# Altium schematic sheet Clocking_SI5341B.SchDoc: RFSoC AMC
size 420 x 297 mm; CompanyName: WUT; DrawnBy: T. Przywozki; Organization: WUT ISE; Address1: Warsaw University of Technology; Address2: Nowowiejska 15/19 00-665 Warsaw; Address3: Tomasz.Przywozki@pw.edu.pl; DocumentNumber: 40; Revision: 1; SheetNumber: 40; SheetTotal: 45; Project: RFSoC AMC; ModifiedBy: T. Przywozki; CreateDate: -; CheckedDate: -; DivGrp: ISE; Designer: T. Przywozki; ModifiedDate: -; ProjectName: ADC/DAC MEZZANINE
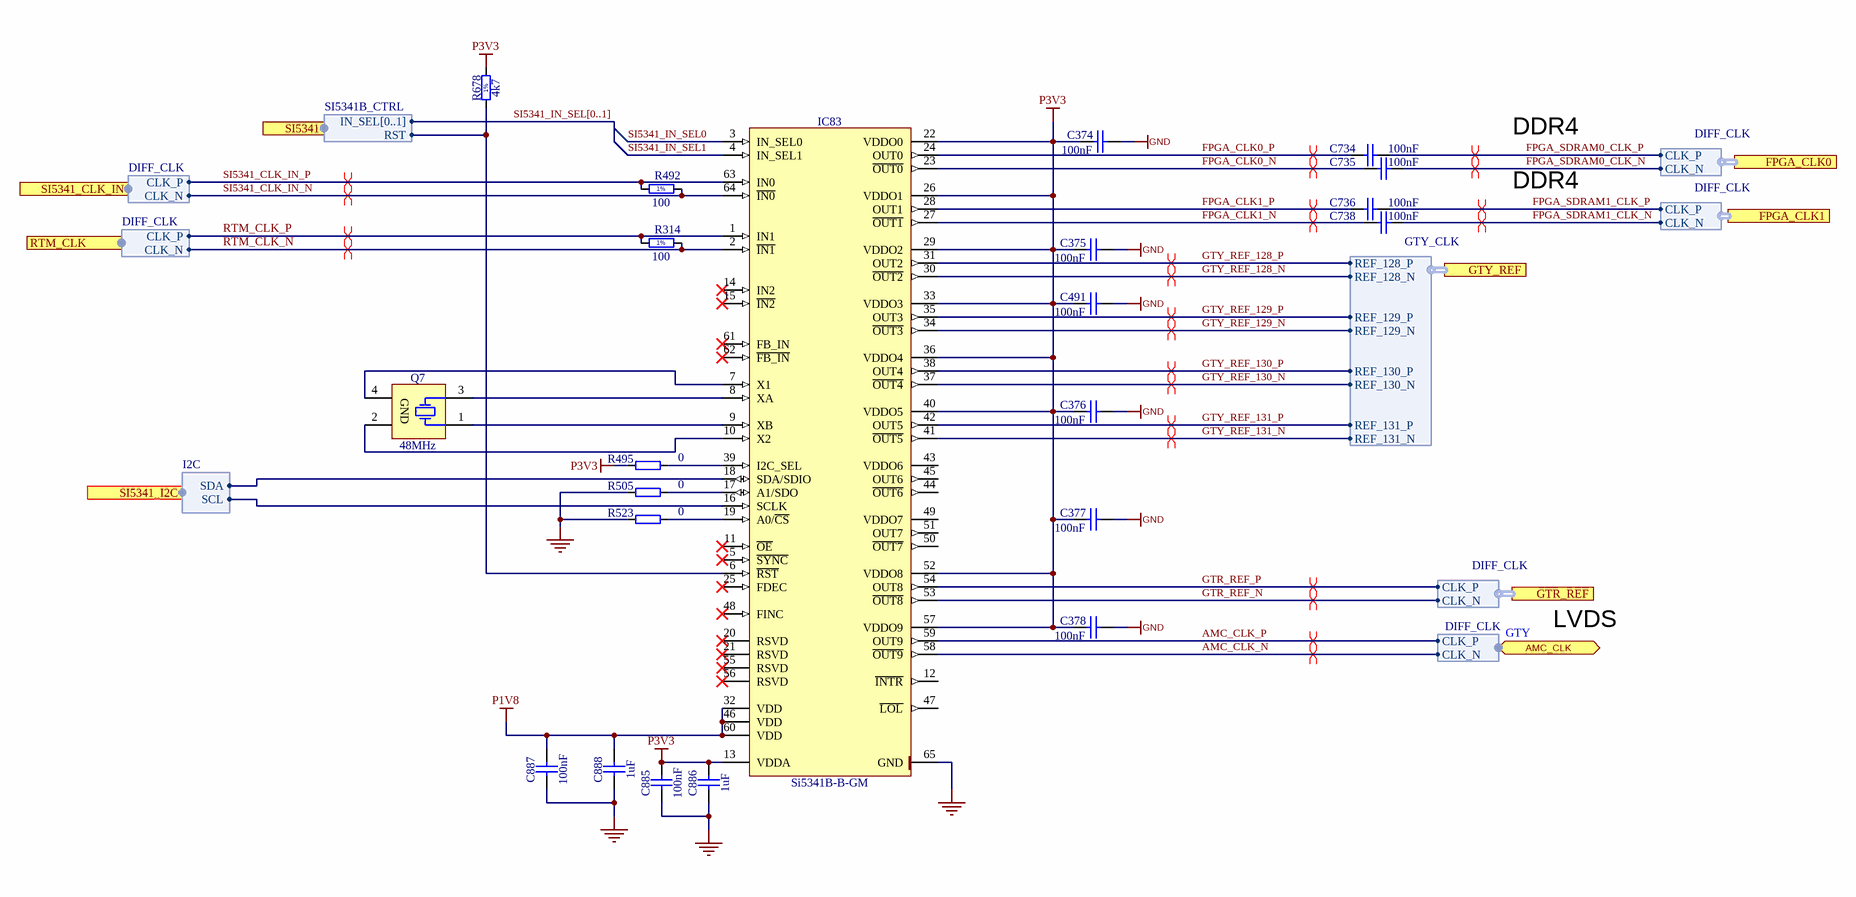
[diagram p0: Clocking_SI5341B.SchDoc]

## Parts
C374  100nF  [CAPC0603X33N]
C375  100nF  [CAPC0603X33N]
C376  100nF  [CAPC0603X33N]
C377  100nF  [CAPC0603X33N]
C378  100nF  [CAPC0603X33N]
C491  100nF  [CAPC0603X33N]
C734  100nF  [CAPC0603X33N]
C735  100nF  [CAPC0603X33N]
C736  100nF  [CAPC0603X33N]
C738  100nF  [CAPC0603X33N]
C885  100nF  [CAPC1005X55N]
C886  1uF  [CAPC1005X55N]
C887  100nF  [CAPC1005X55N]
C888  1uF  [CAPC1005X55N]
IC83  Si5341B-B-GM  [QFN50P900X900X90-65N-S530]
Q7  48MHz  [XTAL_TXC_7M]
R314  100  [RESC1005X40N]
R492  100  [RESC1005X40N]
R495  0  [RESC1005X40N]
R505  0  [RESC1005X40N]
R523  0  [RESC1005X40N]
R678  4k7  [RESC1005X40N]

## Ports
AMC_CLK (bidir, harness DIFF_CLK), FPGA_CLK0 (harness DIFF_CLK), FPGA_CLK1 (harness DIFF_CLK), GTR_REF (harness DIFF_CLK), GTY_REF (harness GTY_CLK), RTM_CLK (harness DIFF_CLK), SI5341 (in, harness SI5341B_CTRL), SI5341_CLK_IN (harness DIFF_CLK), SI5341_I2C (harness I2C)

## Harnesses
I2C: SDA, SCL
DIFF_CLK: CLK_P, CLK_N
GTY_CLK: REF_128_P, REF_128_N, REF_129_P, REF_129_N, REF_130_P, REF_130_N, REF_131_P, REF_131_N
SI5341B_CTRL: IN_SEL[0..1], RST

## Nets
GND: C374.1 C375.1 C376.1 C377.1 C378.1 C491.1 C885.1 C886.2 C887.1 C888.2 IC83.65(GND) R505.1 R523.1
P1V8: C887.2 C888.1 IC83.32(VDD) IC83.46(VDD) IC83.60(VDD)
P3V3: C374.2 C375.2 C376.2 C377.2 C378.2 C491.2 C885.2 C886.1 IC83.13(VDDA) IC83.22(VDDO0) IC83.26(VDDO1) IC83.29(VDDO2) IC83.33(VDDO3) IC83.36(VDDO4) IC83.40(VDDO5) IC83.52(VDDO8) IC83.57(VDDO9) R495.1 R678.2
AMC_CLK_N: IC83.58(~{OUT9}) ; port AMC_CLK.CLK_N
AMC_CLK_P: IC83.59(OUT9) ; port AMC_CLK.CLK_P
FPGA_CLK0_N: C735.1 IC83.23(~{OUT0})
FPGA_CLK0_P: C734.1 IC83.24(OUT0)
FPGA_CLK1_N: C738.1 IC83.27(~{OUT1})
FPGA_CLK1_P: C736.1 IC83.28(OUT1)
FPGA_SDRAM0_CLK_N: C735.2 ; port FPGA_CLK0.CLK_N
FPGA_SDRAM0_CLK_P: C734.2 ; port FPGA_CLK0.CLK_P
FPGA_SDRAM1_CLK_N: C738.2 ; port FPGA_CLK1.CLK_N
FPGA_SDRAM1_CLK_P: C736.2 ; port FPGA_CLK1.CLK_P
GTR_REF_N: IC83.53(~{OUT8}) ; port GTR_REF.CLK_N
GTR_REF_P: IC83.54(OUT8) ; port GTR_REF.CLK_P
GTY_REF_128_N: IC83.30(~{OUT2}) ; port GTY_REF.REF_128_N
GTY_REF_128_P: IC83.31(OUT2) ; port GTY_REF.REF_128_P
GTY_REF_129_N: IC83.34(~{OUT3}) ; port GTY_REF.REF_129_N
GTY_REF_129_P: IC83.35(OUT3) ; port GTY_REF.REF_129_P
GTY_REF_130_N: IC83.37(~{OUT4}) ; port GTY_REF.REF_130_N
GTY_REF_130_P: IC83.38(OUT4) ; port GTY_REF.REF_130_P
GTY_REF_131_N: IC83.41(~{OUT5}) ; port GTY_REF.REF_131_N
GTY_REF_131_P: IC83.42(OUT5) ; port GTY_REF.REF_131_P
RTM_CLK_N: IC83.2(~{IN1}) R314.2 ; port RTM_CLK.CLK_N
RTM_CLK_P: IC83.1(IN1) R314.1 ; port RTM_CLK.CLK_P
SI5341_CLK_IN_N: IC83.64(~{IN0}) R492.2 ; port SI5341_CLK_IN.CLK_N
SI5341_CLK_IN_P: IC83.63(IN0) R492.1 ; port SI5341_CLK_IN.CLK_P
SI5341_IN_SEL0: IC83.3(IN_SEL0)
SI5341_IN_SEL1: IC83.4(IN_SEL1)
NetIC83_6: IC83.6(~{RST}) R678.1 ; port SI5341.RST
NetIC83_7: IC83.7(X1) Q7.4(GND)
NetIC83_8: IC83.8(XA) Q7.3(X)
NetIC83_9: IC83.9(XB) Q7.1(X)
NetIC83_10: IC83.10(X2) Q7.2(GND)
NetIC83_16: IC83.16(SCLK) ; port SI5341_I2C.SCL
NetIC83_17: IC83.17(A1/SDO) R505.2
NetIC83_18: IC83.18(SDA/SDIO) ; port SI5341_I2C.SDA
NetIC83_19: IC83.19(A0/~{CS}) R523.2
NetIC83_39: IC83.39(I2C_SEL) R495.2

Not connected (* = marked no-connect by the designer): IC83 5(~{SYNC})* 11(~{OE})* 12(~{INTR}) 14(IN2)* 15(~{IN2})* 20(RSVD)* 21(RSVD)* 25(FDEC)* 43(VDDO6) 44(~{OUT6}) 45(OUT6) 47(~{LOL}) 48(FINC)* 49(VDDO7) 50(~{OUT7}) 51(OUT7) 55(RSVD)* 56(RSVD)* 61(FB_IN)* 62(~{FB_IN})*

## Buses and harness runs
bus SI5341_IN_SEL[0..1]

## Layout directives
differential pair; net class Diff_100Ohm: AMC_CLK_N, AMC_CLK_P, FPGA_CLK0_N, FPGA_CLK0_P, FPGA_CLK1_N, FPGA_CLK1_P, FPGA_SDRAM0_CLK_N, FPGA_SDRAM0_CLK_P, FPGA_SDRAM1_CLK_N, FPGA_SDRAM1_CLK_P, GTR_REF_N, GTR_REF_P, GTY_REF_128_N, GTY_REF_128_P, GTY_REF_129_N, GTY_REF_129_P, GTY_REF_130_N, GTY_REF_130_P, GTY_REF_131_N, GTY_REF_131_P, RTM_CLK_N, RTM_CLK_P, SI5341_CLK_IN_N, SI5341_CLK_IN_P

## Notes on the sheet
- DDR4
- GTY
- LVDS
- Project/Equipment
- Document
- Designer
- Drawn by
- Check.by
- Copyright WUT ISE 2021
  This documentation describes Open Hardware and is licensed under CERN OHL v.1.1. You may redistribute and modify this documentaction under the terms of the CERN OHL v1.1.
  (http://ohwr.org/CERNOHL). This documentation is dristributed WITHOUT ANY EXPRESS OR IMPLIED WARRANTY, INCLUDING OF MERCHANTABLITY, SATISFACTORY QUALITY AND FITNESS FOR A PARTICULAR PURPOSE. Please see the CERN OHL v.1.1 for applicable conditions
- File
- Last Mod.
- Print Date
- Sheet
- Size
- A3
- of
- Rev
- Contact:
- (in symbol R0402_4K7_1%_0.0625W_100PPM) 1%
- (in symbol R0402_100R_1%_0.0625W_100PPM) 1%

## Library data of the parts
C374-C378 C491 = CC0201_100NF_6.3V_10%_X5R: Non-polarised capacitor; Manufacturer: GENERIC; Part Description: SMD Multilayer Chip Ceramic Capacitor; Manufacturer1 Part Number: 02016D104KAT2A; Tolerance: ±10%; Voltage: 6.3V; TC: X5R; Manufacturer Part Number: CC0201_100NF_6.3V_10%_X5R; Part Number: CC0201_100NF_6.3V_10%_X5R; Value: 100nF; Component Kind: Standard; Component Type: Standard; Pin Count: 2; Status: Not Recommended; Case: 0201; Mounted: Yes; Socket: No; SMD: Yes; Sense: No; Manufacturer1 Example: AVX; Manufacturer1 ComponentHeight: 0.33mm; HelpURL: \\cern.ch\dfs\Applications\Altium\Datasheets\CC0201_X5R_AVX.pdf; Author: CERN DEM JLC; CreateDate: 03/12/2007; LatestRevisionDate: 03/12/2007
C734-C736 C738 = CC0201_100NF_6.3V_10%_X5R: Non-polarised capacitor; Manufacturer: GENERIC; Manufacturer1 Part Number: 02016D104KAT2A; Part Description: SMD Multilayer Chip Ceramic Capacitor; TC: X5R; Tolerance: ±10%; Voltage: 6.3V; Case: 0201; Manufacturer Part Number: CC0201_100NF_6.3V_10%_X5R; Manufacturer1 Example: AVX; Part Number: CC0201_100NF_6.3V_10%_X5R; Pin Count: 2; SMD: Yes; Status: Not Recommended; Value: 100nF; Component Kind: Standard; Component Type: Standard; Mounted: Yes; Socket: No; Sense: No; Manufacturer1 ComponentHeight: 0.33mm; HelpURL: \\cern.ch\dfs\Applications\Altium\Datasheets\CC0201_X5R_AVX.pdf; Author: CERN DEM JLC; CreateDate: 03.12.2007; LatestRevisionDate: 03.12.2007
C885 C887 = CC0402_100NF_25V_10%_X7R_YUDEN_TMK105B7104KVHF: Non-polarised capacitor; Part Description: SMD Multilayer Chip Ceramic Capacitor (High Dielectric Type) for Automotive / Industrial Applications; Manufacturer: TAIYO YUDEN; Voltage: 25V; TC: X7R; Tolerance: ±10%; Part Number: CC0402_100NF_25V_10%_X7R_YUDEN_TMK105B7104KVHF; Component Kind: Standard; Component Type: Standard; Pin Count: 2; Value: 100nF; Status: Not Recommended; Manufacturer Part Number: TMK105B7104KVHF; Case: 0402; Mounted: Yes; Socket: No; SMD: Yes; Sense: No; ComponentHeight: 0.55mm; HelpURL: \\cern.ch\dfs\Applications\Altium\Datasheets\CC0402_TAIYO-YUDEN_TMK105B7104KVHF.pdf; Author: CERN DEM JLC; CreateDate: 10.05.2017; LatestRevisionDate: 10.05.2017
C886 C888 = CC0402_1UF_16V_10%_X5R: Non-polarised capacitor; Part Description: SMD Multilayer Chip Ceramic Capacitor; Manufacturer: GENERIC; Manufacturer1 Part Number: C1005X5R1C105KT; Voltage: 16V; TC: X5R; Tolerance: ±10%; Part Number: CC0402_1UF_16V_10%_X5R; Component Kind: Standard; Component Type: Standard; Pin Count: 2; Value: 1uF; Status: Preferred; Manufacturer Part Number: CC0402_1UF_16V_10%_X5R; Case: 0402; Mounted: Yes; Socket: No; SMD: Yes; Sense: No; Manufacturer1 Example: TDK; Manufacturer1 ComponentHeight: 0.55mm; HelpURL: \\cern.ch\dfs\Applications\Altium\Datasheets\CC0402_X5R_TDK_C.pdf; Author: CERN DEM JLC; CreateDate: 25.10.2012; LatestRevisionDate: 25.10.2012
IC83 = Si5341B-B-GM: Low-Jitter, 10-Output, Any-Frequency, Any-Output, Clock Generator; Part Description: 0.0001 to 350 MHz, Low-Jitter, 4-Input, 10-Output, Clock Generator; Manufacturer: SILICON LABS; PressFit: No; Bonding: No; Part Number: Si5341B-B-GM; Component Kind: Standard; Component Type: Standard; Device: Si5341B-B-GM; PackageDescription: QFN, 0.50mm Pitch, Square; 64 Pin, 9.00mm L X 9.00mm W X 0.90mm H Body (5.30mm X 5.30mm Thermal Tab), IPC Medium Density; Manufacturer Part Number: Si5341B-B-GM; Pin Count: 65; Case: QFN64; Mounted: Yes; Socket: No; SMD: Yes; Sense: No; ComponentHeight: 0.9mm; HelpURL: \\cern.ch\dfs\Applications\Altium\Datasheets\Si5341B-B-GM.pdf; Author: CERN DEM MR; CreateDate: 25.05.2016; LatestRevisionDate: 23.10.2017
Q7 = XTAL_48MHZ_TXC_7M-48.000MAHV: Crystal 4 pins 1=XTAL Control 2=GND3=XTAL 4=GND; Part Description: ±30ppm 8pF -40°C to +85°C  4 Pins, 3.2x2.5X0.8mm, SMD Sealing Crystal, 7M Series; Manufacturer: TXC CORPORATION; PressFit: No; Bonding: No; Part Number: XTAL_48MHZ_TXC_7M-48.000MAHV; Component Kind: Standard; Component Type: Standard; PackageDescription: 4 Pins, 2.5x3.2mm, SMD Sealing Crystal, 7M Serie; Value: 48MHz; Manufacturer Part Number: 7M-48.000MAHV; Pin Count: 4; Mounted: Yes; Socket: No; SMD: Yes; Sense: No; ComponentHeight: 0.8mm; HelpURL: \\cern.ch\dfs\Applications\Altium\Datasheets\XTAL_TXC_7M.pdf; Author: CERN DEM MR; CreateDate: 30.05.2016; LatestRevisionDate: 30.05.2016
R314 R492 = R0402_100R_1%_0.0625W_100PPM: Resistor - 1%; Manufacturer: GENERIC; Part Description: General Purpose Thick Film Chip Resistor; Manufacturer1 Part Number: 232270671001L; TC: ±100ppm/°C; PressFit: No; Manufacturer Part Number: R0402_100R_1%_0.0625W_100PPM; Part Number: R0402_100R_1%_0.0625W_100PPM; Tolerance: ±1%; Value: 100; Component Kind: Standard; Component Type: Standard; Pin Count: 2; Status: Not Recommended; Power: 0.0625W; Case: 0402; Mounted: Yes; Sense: No; Socket: No; SMD: Yes; Manufacturer1 Example: YAGEO PHYCOMP; Manufacturer1 ComponentHeight: 0.4mm; HelpURL: \\cern.ch\dfs\Applications\Altium\Datasheets\R0402_Phycomp_RC0402.pdf; Author: CERN DEM JLC; CreateDate: 03.12.2007; LatestRevisionDate: 17.10.2012
R495 R505 R523 = R0402_0R_JUMPER: Resistor; Manufacturer: GENERIC; Part Description: 1A (0.05R Max DC Resistance) Zero Ohm Jumper; Manufacturer1 Part Number: 232270591001L; PressFit: No; Manufacturer Part Number: R0402_0R_JUMPER; Part Number: R0402_0R_JUMPER; Value: 0; Component Kind: Standard; Component Type: Standard; Pin Count: 2; Status: Not Recommended; Case: 0402; Mounted: Yes; Sense: No; Socket: No; SMD: Yes; Manufacturer1 Example: YAGEO PHYCOMP; Manufacturer1 ComponentHeight: 0.4mm; HelpURL: \\cern.ch\dfs\Applications\Altium\Datasheets\R0402_Phycomp_RC0402.pdf; Author: CERN DEM JLC; CreateDate: 03.12.2007; LatestRevisionDate: 17.10.2012
R678 = R0402_4K7_1%_0.0625W_100PPM: Resistor - 1%; Part Description: General Purpose Thick Film Chip Resistor; Manufacturer: GENERIC; Manufacturer1 Part Number: 232270674702L; TC: ±100ppm/°C; PressFit: No; Part Number: R0402_4K7_1%_0.0625W_100PPM; Component Kind: Standard; Component Type: Standard; Pin Count: 2; Value: 4k7; Status: Not Recommended; Power: 0.0625W; Tolerance: ±1%; Manufacturer Part Number: R0402_4K7_1%_0.0625W_100PPM; Case: 0402; Mounted: Yes; Sense: No; Socket: No; SMD: Yes; Manufacturer1 Example: YAGEO PHYCOMP; Manufacturer1 ComponentHeight: 0.4mm; HelpURL: \\cern.ch\dfs\Applications\Altium\Datasheets\R0402_Phycomp_RC0402.pdf; Author: CERN DEM JLC; CreateDate: 03.12.2007; LatestRevisionDate: 17.10.2012